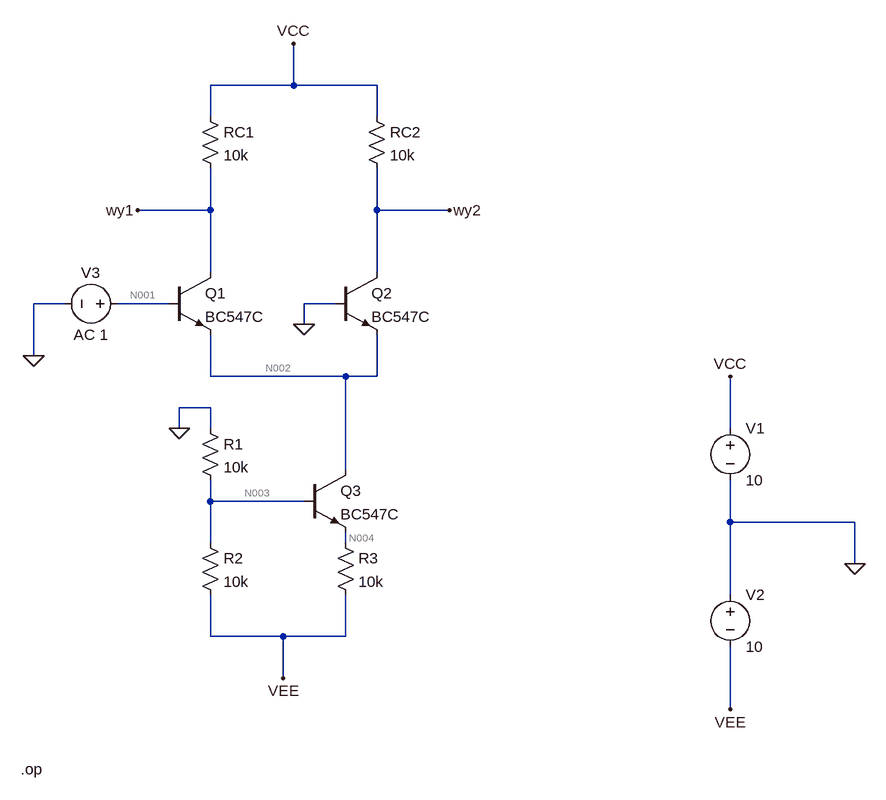
[diagram p0: schematic Draft1.asc]
Draft1.asc, the LTspice schematic file:
Version 4
SHEET 1 1172 1164
WIRE 288 96 288 32
WIRE 288 96 160 96
WIRE 416 96 288 96
WIRE 160 144 160 96
WIRE 416 144 416 96
WIRE 160 288 160 224
WIRE 160 288 48 288
WIRE 416 288 416 224
WIRE 528 288 416 288
WIRE 160 384 160 288
WIRE 416 384 416 288
WIRE -64 432 -112 432
WIRE 96 432 16 432
WIRE 352 432 304 432
WIRE 304 464 304 432
WIRE -112 512 -112 432
WIRE 160 544 160 480
WIRE 368 544 160 544
WIRE 416 544 416 480
WIRE 416 544 368 544
WIRE 160 592 112 592
WIRE 112 624 112 592
WIRE 160 624 160 592
WIRE 960 624 960 544
WIRE 368 688 368 544
WIRE 160 736 160 704
WIRE 304 736 160 736
WIRE 960 768 960 704
WIRE 1152 768 960 768
WIRE 160 800 160 736
WIRE 368 800 368 784
WIRE 1152 832 1152 768
WIRE 960 880 960 768
WIRE 160 944 160 880
WIRE 272 944 160 944
WIRE 368 944 368 880
WIRE 368 944 272 944
WIRE 272 1008 272 944
WIRE 960 1056 960 960
FLAG 304 464 0
FLAG 288 32 VCC
FLAG 48 288 wy1
FLAG 528 288 wy2
FLAG -112 512 0
FLAG 112 624 0
FLAG 272 1008 VEE
FLAG 1152 832 0
FLAG 960 544 VCC
FLAG 960 1056 VEE
SYMBOL res 144 128 R0
SYMATTR InstName RC1
SYMATTR Value 10k
SYMBOL res 400 128 R0
SYMATTR InstName RC2
SYMATTR Value 10k
SYMBOL npn 96 384 R0
SYMATTR InstName Q1
SYMATTR Value BC547C
SYMBOL npn 352 384 R0
SYMATTR InstName Q2
SYMATTR Value BC547C
SYMBOL voltage 32 432 R90
WINDOW 0 -32 56 VBottom 2
WINDOW 3 32 56 VTop 2
SYMATTR InstName V3
SYMATTR Value AC 1
SYMBOL npn 304 688 R0
SYMATTR InstName Q3
SYMATTR Value BC547C
SYMBOL res 144 608 R0
SYMATTR InstName R1
SYMATTR Value 10k
SYMBOL res 144 784 R0
SYMATTR InstName R2
SYMATTR Value 10k
SYMBOL res 352 784 R0
SYMATTR InstName R3
SYMATTR Value 10k
SYMBOL voltage 960 608 R0
WINDOW 123 0 0 Left 0
WINDOW 39 0 0 Left 0
SYMATTR InstName V1
SYMATTR Value 10
SYMBOL voltage 960 864 R0
SYMATTR InstName V2
SYMATTR Value 10
TEXT -132 1148 Left 2 !.op

The netlist it stands for:
* Draft1.asc
RC1 VCC wy1 10k
RC2 VCC wy2 10k
Q1 wy1 N001 N002 0 BC547C
Q2 wy2 0 N002 0 BC547C
V3 N001 0 AC 1
Q3 N002 N003 N004 0 BC547C
R1 0 N003 10k
R2 N003 VEE 10k
R3 N004 VEE 10k
V1 VCC 0 10
V2 0 VEE 10
.model NPN NPN
.model PNP PNP
.lib standard.bjt
.op
.backanno
.end

* Results of the author's LTspice run, read from the files saved beside the schematic
* Operating Point:
*   V(vcc) = 10 V
*   V(wy1) = 7.81 V
*   V(wy2) = 7.81 V
*   V(n001) = 0 V
*   V(n002) = -578.2 mV
*   V(n003) = -5.004 V
*   V(n004) = -5.602 V
*   V(vee) = -10 V
*   Ic(Q1) = 219 µA
*   Ib(Q1) = 420.6 nA
*   Ie(Q1) = -219.4 µA
*   Ic(Q2) = 219 µA
*   Ib(Q2) = 420.6 nA
*   Ie(Q2) = -219.4 µA
*   Ic(Q3) = 438.9 µA
*   Ib(Q3) = 892.4 nA
*   Ie(Q3) = -439.8 µA
*   I(Rc1) = 219 µA
*   I(Rc2) = 219 µA
*   I(R1) = 500.4 µA
*   I(R2) = 499.6 µA
*   I(R3) = 439.8 µA
*   I(V3) = -420.6 nA
*   I(V1) = -438 µA
*   I(V2) = -939.3 µA
* From the log:
*   Semiconductor Device Operating Points:
*                           --- Bipolar Transistors ---
*   Name:       q1          q2          q3
*   Model:    bc547c      bc547c      bc547c
*   Ib:       4.21e-07    4.21e-07    8.92e-07
*   Ic:       2.19e-04    2.19e-04    4.39e-04
*   Vbe:      5.78e-01    5.78e-01    5.98e-01
*   Vbc:     -7.81e+00   -7.81e+00   -4.43e+00
*   Vce:      8.39e+00    8.39e+00    5.02e+00
*   BetaDC:   5.21e+02    5.21e+02    4.92e+02
*   Gm:       8.37e-03    8.37e-03    1.67e-02
*   Rpi:      6.23e+04    6.23e+04    2.93e+04
*   Rx:       1.00e+00    1.00e+00    1.00e+00
*   Ro:       2.76e+05    2.76e+05    1.30e+05
*   Cbe:      3.32e-11    3.32e-11    3.83e-11
*   Cbc:      9.80e-13    9.80e-13    1.14e-12
*   Cjs:      0.00e+00    0.00e+00    0.00e+00
*   BetaAC:   5.21e+02    5.21e+02    4.91e+02
*   Cbx:      6.02e-13    6.02e-13    7.02e-13
*   Ft:       3.83e+07    3.83e+07    6.64e+07